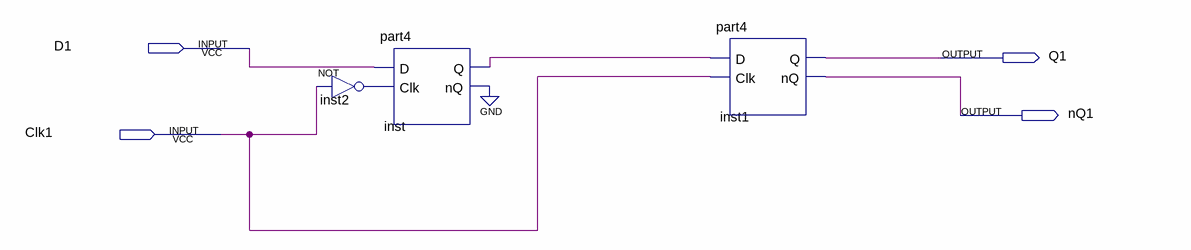
[diagram p0: schematic sheet]
// Quartus schematic fpd.bdf as structural Verilog: 3 symbols, 4 pins
module fpd (
  input  D1,
  input  Clk1,
  output Q1,
  output nQ1
);

  wire inst2_out, inst_nq, inst_q;

  not inst2 (inst2_out, Clk1);
  part4 inst (.D(D1), .Clk(inst2_out), .Q(inst_q), .nQ(inst_nq));
  part4 inst1 (.D(inst_q), .Clk(Clk1), .Q(Q1), .nQ(nQ1));
  // also tied to GND on the sheet: inst_nq
endmodule
